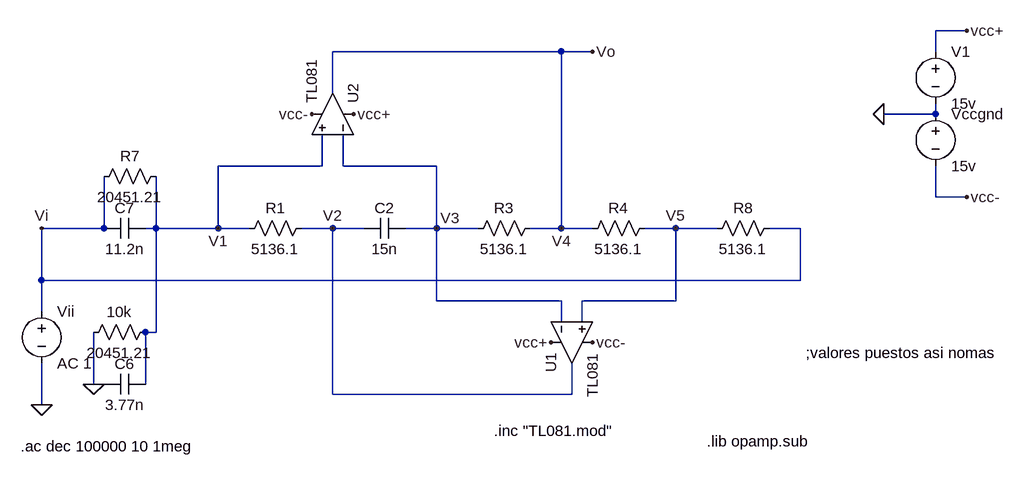
[diagram p0: schematic Simulacion.asc]
Simulacion.asc, the LTspice schematic file:
Version 4
SHEET 1 1384 680
WIRE 1280 -272 1232 -272
WIRE 656 -240 304 -240
WIRE 704 -240 656 -240
WIRE 1232 -240 1232 -272
WIRE 304 -176 304 -240
WIRE 1232 -144 1232 -160
WIRE 1232 -144 1152 -144
WIRE 288 -64 288 -112
WIRE 288 -64 128 -64
WIRE 320 -64 320 -112
WIRE 464 -64 320 -64
WIRE 1232 -16 1232 -64
WIRE 1280 -16 1232 -16
WIRE -48 32 -48 -48
WIRE -48 32 -144 32
WIRE 32 32 32 -48
WIRE 32 32 16 32
WIRE 128 32 128 -64
WIRE 128 32 32 32
WIRE 176 32 128 32
WIRE 304 32 256 32
WIRE 352 32 304 32
WIRE 464 32 464 -64
WIRE 464 32 416 32
WIRE 528 32 464 32
WIRE 656 32 656 -240
WIRE 656 32 608 32
WIRE 704 32 656 32
WIRE 832 32 784 32
WIRE 896 32 832 32
WIRE 1024 32 976 32
WIRE -144 112 -144 32
WIRE 1024 112 1024 32
WIRE 1024 112 -144 112
WIRE 464 144 464 32
WIRE 656 144 464 144
WIRE 832 144 832 32
WIRE 832 144 688 144
WIRE -144 160 -144 112
WIRE 656 176 656 144
WIRE 688 176 688 144
WIRE 32 192 32 32
WIRE 32 192 16 192
WIRE -64 272 -64 192
WIRE -48 272 -64 272
WIRE 16 272 16 192
WIRE 304 288 304 32
WIRE 672 288 672 240
WIRE 672 288 304 288
WIRE -144 304 -144 240
FLAG -144 304 0
FLAG 704 -240 Vo
FLAG -144 32 Vi
FLAG 128 32 V1
FLAG 304 32 V2
FLAG 464 32 V3
FLAG 656 32 V4
FLAG 832 32 V5
FLAG 1280 -272 vcc+
FLAG 1280 -16 vcc-
FLAG 1152 -144 0
FLAG -64 272 0
FLAG 640 208 vcc+
FLAG 336 -144 vcc+
FLAG 272 -144 vcc-
FLAG 704 208 vcc-
SYMBOL res 272 16 R90
WINDOW 0 0 56 VBottom 2
WINDOW 3 32 56 VTop 2
SYMATTR InstName R1
SYMATTR Value 5136.1
SYMBOL cap 416 16 R90
WINDOW 0 0 32 VBottom 2
WINDOW 3 32 32 VTop 2
SYMATTR InstName C2
SYMATTR Value 15n
SYMBOL res 624 16 R90
WINDOW 0 0 56 VBottom 2
WINDOW 3 32 56 VTop 2
SYMATTR InstName R3
SYMATTR Value 5136.1
SYMBOL res 800 16 R90
WINDOW 0 0 56 VBottom 2
WINDOW 3 32 56 VTop 2
SYMATTR InstName R4
SYMATTR Value 5136.1
SYMBOL res 992 16 R90
WINDOW 0 0 56 VBottom 2
WINDOW 3 32 56 VTop 2
SYMATTR InstName R8
SYMATTR Value 5136.1
SYMBOL voltage -144 144 R0
WINDOW 123 0 0 Left 0
WINDOW 39 0 0 Left 0
SYMATTR InstName Vii
SYMATTR Value AC 1
SYMBOL cap 16 256 R90
WINDOW 0 0 32 VBottom 2
WINDOW 3 32 32 VTop 2
SYMATTR InstName C6
SYMATTR Value 3.77n
SYMBOL res 32 176 R90
WINDOW 0 0 56 VBottom 2
WINDOW 3 32 56 VTop 2
SYMATTR InstName 10k
SYMATTR Value 20451.21
SYMBOL voltage 1232 -256 R0
SYMATTR InstName V1
SYMATTR Value 15v
SYMBOL voltage 1232 -160 R0
SYMATTR InstName Vccgnd
SYMATTR Value 15v
SYMBOL cap 16 16 R90
WINDOW 0 0 32 VBottom 2
WINDOW 3 32 32 VTop 2
SYMATTR InstName C7
SYMATTR Value 11.2n
SYMBOL res 48 -64 R90
WINDOW 0 0 56 VBottom 2
WINDOW 3 32 56 VTop 2
SYMATTR InstName R7
SYMATTR Value 20451.21
SYMBOL Opamps\\opamp2 368 -144 M270
SYMATTR InstName U2
SYMATTR Value TL081
SYMBOL Opamps\\opamp2 608 208 M90
SYMATTR InstName U1
SYMATTR Value TL081
TEXT 552 344 Left 2 !.inc "TL081.mod"
TEXT -176 368 Left 2 !.ac dec 100000 10 1meg
TEXT 1032 224 Left 2 !;valores puestos asi nomas
TEXT 880 360 Left 2 !.lib opamp.sub

The netlist it stands for:
* Simulacion.asc
R1 V2 V1 5136.1
C2 V3 V2 15n
R3 V4 V3 5136.1
R4 V5 V4 5136.1
R8 Vi V5 5136.1
Vii Vi 0 AC 1
C6 V1 0 3.77n
R§10k V1 0 20451.21
V1 vcc+ 0 15v
Vccgnd 0 vcc- 15v
C7 V1 Vi 11.2n
R7 V1 Vi 20451.21
XU2 V1 V3 vcc+ vcc- V4 TL081  ; pins In+ In- V+ V- OUT
XU1 V5 V3 vcc+ vcc- V2 TL081  ; pins In+ In- V+ V- OUT
.inc "TL081.mod"
.ac dec 100000 10 1meg
;valores puestos asi nomas
.lib opamp.sub
.backanno
.end